# EAGLE design couch-pwr-rb (EAGLE 7.6.0)
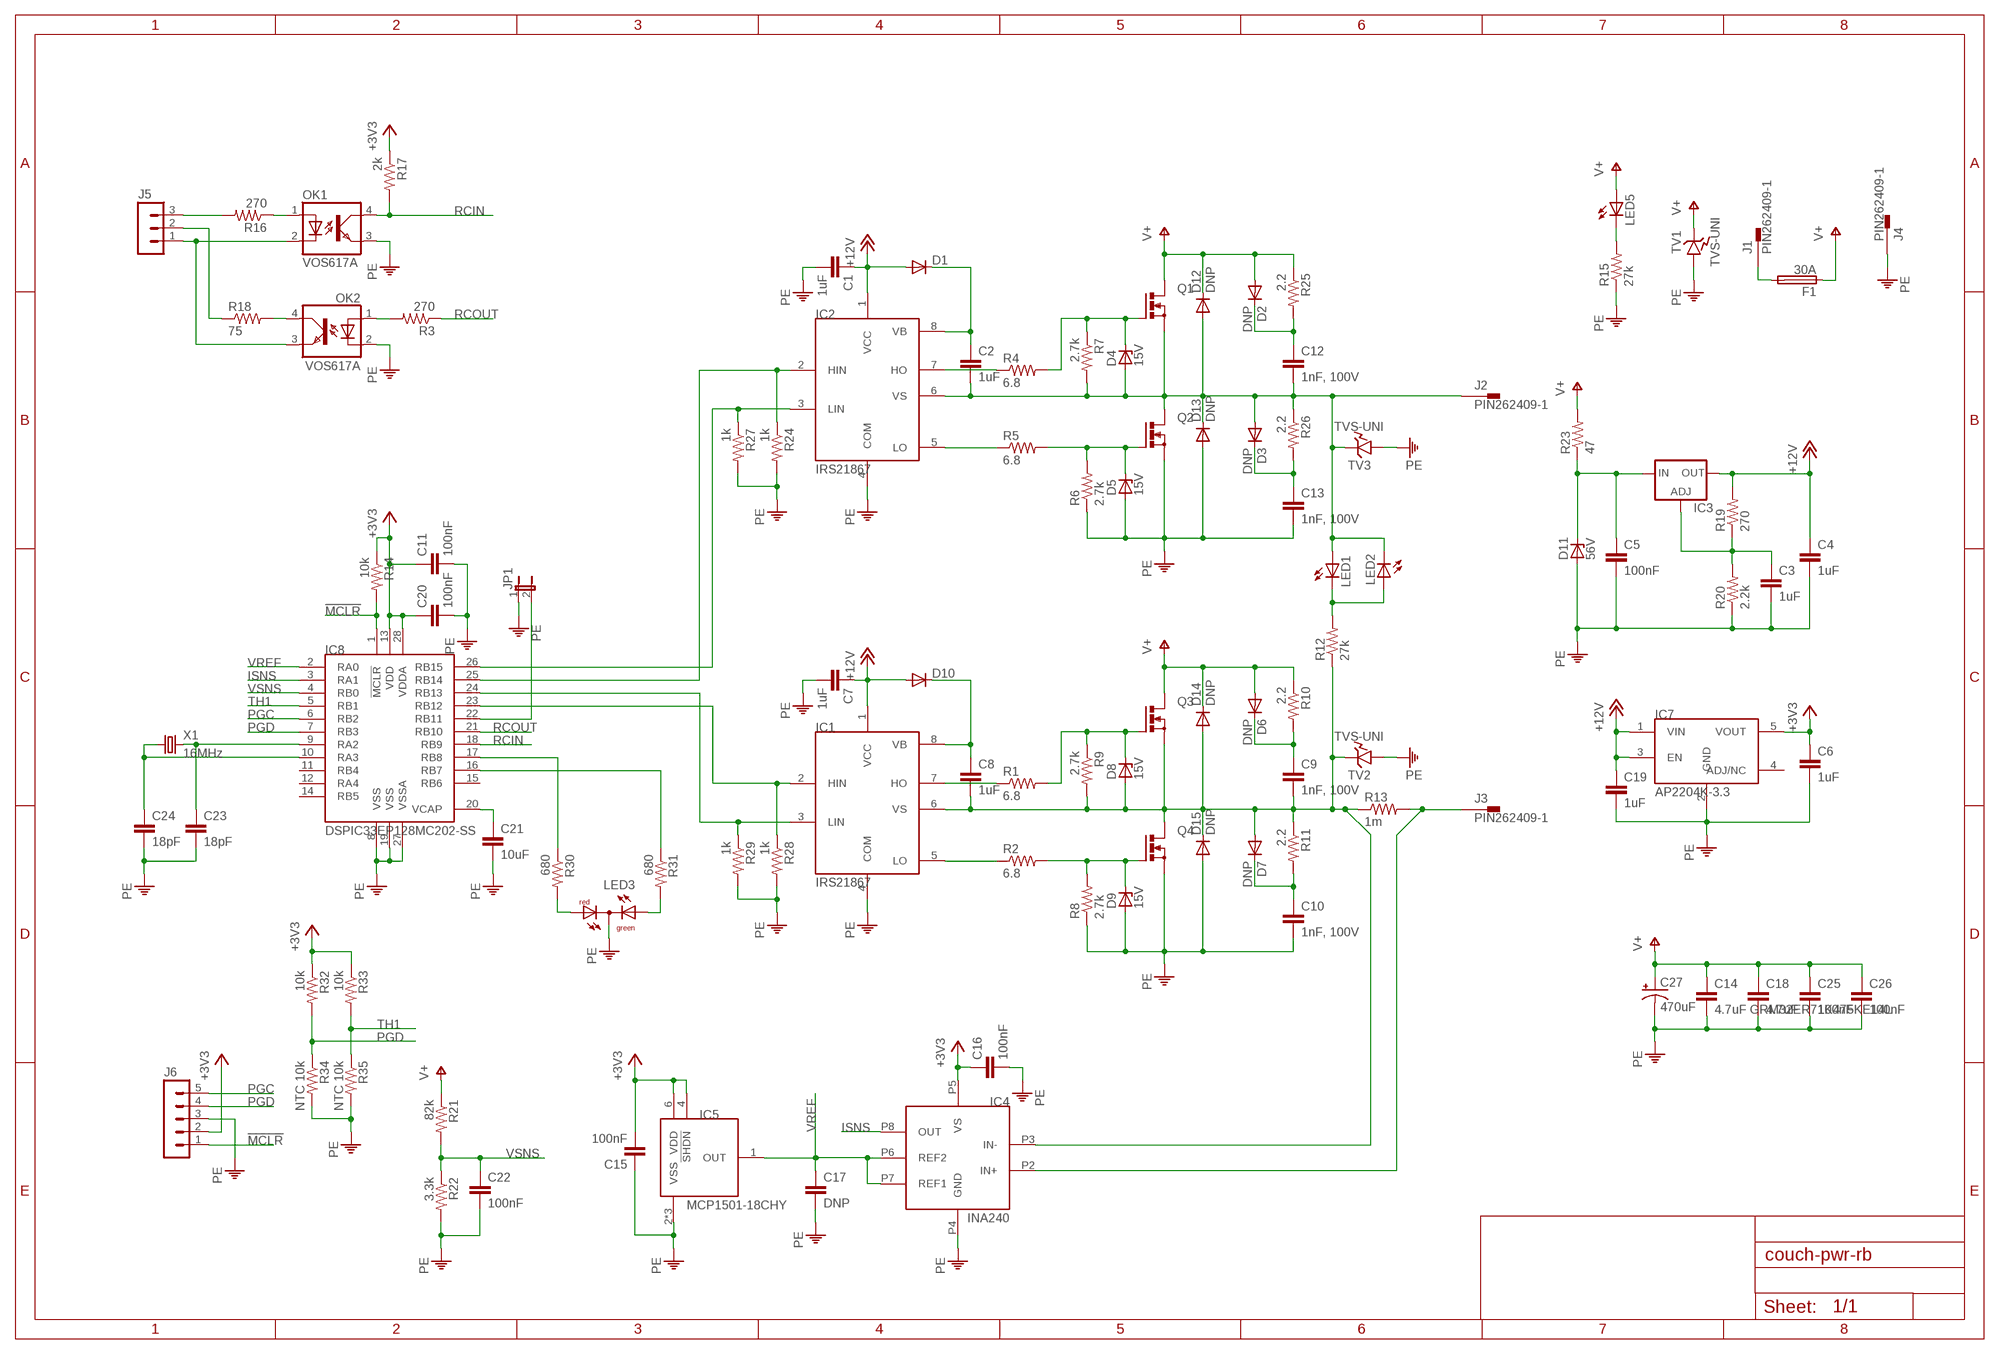
[diagram p0: schematic, sheet 1]

## Parts
C1  1uF  C-EUC0805  [C0805]
C2  1uF  C-EUC0805  [C0805]
C3  1uF  C-EUC0805  [C0805]
C4  1uF  C-EUC0805  [C0805]
C5  100nF  C-EUC0805  [C0805]
C6  1uF  C-EUC0603  [C0603]
C7  1uF  C-EUC0805  [C0805]
C8  1uF  C-EUC0805  [C0805]
C9  1nF, 100V  C-EUC1206  [C1206]
C10  1nF, 100V  C-EUC1206  [C1206]
C11  100nF  C-EUC0603  [C0603]
C12  1nF, 100V  C-EUC1206  [C1206]
C13  1nF, 100V  C-EUC1206  [C1206]
C14  4.7uF GRM32ER71K475KE14L  C-EUC1210  [C1210]
C15  100nF  C-EUC0603  [C0603]
C16  100nF  C-EUC0603  [C0603]
C17  DNP  C-EUC0603  [C0603]
C18  4.7uF  C-EUC1210  [C1210]
C19  1uF  C-EUC0603  [C0603]
C20  100nF  C-EUC0603  [C0603]
C21  10uF  C-EUC0603  [C0603]
C22  100nF  C-EUC0603  [C0603]
C23  18pF  C-EUC0603  [C0603]
C24  18pF  C-EUC0603  [C0603]
C25  100nF  C-EUC1206  [C1206]
C26  100nF  C-EUC1206  [C1206]
C27  470uF  CPOL-USE7.5-16  [E7,5-16]
D1  DIODE-SOD323-W  [SOD323-W]
D2  DNP  DIODE-DO-214AC  [DO-214AC]
D3  DNP  DIODE-DO-214AC  [DO-214AC]
D4  15V  ZENER-DIODESOD80C  [SOD80C]
D5  15V  ZENER-DIODESOD80C  [SOD80C]
D6  DNP  DIODE-DO-214AC  [DO-214AC]
D7  DNP  DIODE-DO-214AC  [DO-214AC]
D8  15V  ZENER-DIODESOD80C  [SOD80C]
D9  15V  ZENER-DIODESOD80C  [SOD80C]
D10  DIODE-SOD323-W  [SOD323-W]
D11  56V  ZENER-DIODESMB  [SMB]
D12  DNP  DIODE-SMC  [SMC]
D13  DNP  DIODE-SMC  [SMC]
D14  DNP  DIODE-SMC  [SMC]
D15  DNP  DIODE-SMC  [SMC]
F1  30A  FUSEBLADE  [BLADEFUSE]
IC1  IRS21867  [SO-08]
IC2  IRS21867  [SO-08]
IC3  LM317TLBH  [TO220BH]
IC4  INA240  [VSSOP-8]
IC5  MCP1501-18CHY  [SOT23-6]
IC7  AP2204K-3.3  AP2204K-5.0  [SOT23-5]
IC8  DSPIC33EP128MC202-SS  [SSOP-28]
J1  PIN262409-1  [62409-1]
J2  PIN262409-1  [62409-1]
J3  PIN262409-1  [62409-1]
J4  PIN262409-1  [62409-1]
J5  MA03-1  [MA03-1]
J6  MA05-1  [MA05-1]
JP1  JP1E  [JP1]
LED1  LEDCHIP-LED0603  [CHIP-LED0603]
LED2  LEDCHIP-LED0603  [CHIP-LED0603]
LED3  DUOLED-RG-C  [DUOLED-C-5MM]
LED5  LEDCHIP-LED0603  [CHIP-LED0603]
OK1  VOS617A  TLP283  [MINI-FLAT-4]
OK2  VOS617A  TLP283  [MINI-FLAT-4]
Q1  PMOSFET_NTO220BH  [TO220BH]
Q2  PMOSFET_NTO220BH  [TO220BH]
Q3  PMOSFET_NTO220BH  [TO220BH]
Q4  PMOSFET_NTO220BH  [TO220BH]
R1  6.8  R-US_R1206  [R1206]
R2  6.8  R-US_R1206  [R1206]
R3  270  R-US_R0603  [R0603]
R4  6.8  R-US_R1206  [R1206]
R5  6.8  R-US_R1206  [R1206]
R6  2.7k  R-US_R0603  [R0603]
R7  2.7k  R-US_R0603  [R0603]
R8  2.7k  R-US_R0603  [R0603]
R9  2.7k  R-US_R0603  [R0603]
R10  2.2  R-US_R1206  [R1206]
R11  2.2  R-US_R1206  [R1206]
R12  27k  R-US_R0603  [R0603]
R13  1m  R-US_R2512  [R2512]
R14  10k  R-US_R0603  [R0603]
R15  27k  R-US_R0603  [R0603]
R16  270  R-US_R0603  [R0603]
R17  2k  R-US_R0603  [R0603]
R18  75  R-US_R0603  [R0603]
R19  270  R-US_R0603  [R0603]
R20  2.2k  R-US_R0603  [R0603]
R21  82k  R-US_R0603  [R0603]
R22  3.3k  R-US_R0603  [R0603]
R23  47  R-US_R1206  [R1206]
R24  1k  R-US_R0603  [R0603]
R25  2.2  R-US_R1206  [R1206]
R26  2.2  R-US_R1206  [R1206]
R27  1k  R-US_R0603  [R0603]
R28  1k  R-US_R0603  [R0603]
R29  1k  R-US_R0603  [R0603]
R30  680  R-US_R0603  [R0603]
R31  680  R-US_R0603  [R0603]
R32  10k  R-US_R0603  [R0603]
R33  10k  R-US_R0603  [R0603]
R34  NTC 10k  R-US_R0603  [R0603]
R35  NTC 10k  R-US_R0603  [R0603]
TV1  TVS-UNI  [SMC]
TV2  TVS-UNI  [SMC]
TV3  TVS-UNI  [SMC]
X1  16MHz  CRYSTALHC49S  [HC49/S]

## Nets
!MCLR: IC8.1(!MCLR) J6.1 R14.2
+3V3: C6.1 C11.1 C15.2 C16.1 C20.1 IC4.P5(VS) IC5.4(!SHDN) IC5.6(VDD) IC7.5(VOUT) IC8.13(VDD) IC8.28(VDDA) J6.2 R14.1 R17.1 R32.1 R33.1
+12V: C1.1 C4.1 C7.1 C19.1 D1.A D10.A IC1.1(VCC) IC2.1(VCC) IC3.D(OUT) IC7.1(VIN) IC7.3(EN) R19.2
ISNS: IC4.P8(OUT) IC8.3(RA1)
MD1: C2.2 C12.2 D3.A D4.A D12.A D13.C IC2.6(VS) J2.A1 J2.A2 LED1.A LED2.C Q1.S Q2.D R7.2 R26.1 TV3.1(M1)
MD2: C8.2 C9.2 D7.A D8.A D14.A D15.C IC1.6(VS) IC4.P3(IN-) Q3.S Q4.D R9.2 R11.1 R12.1 R13.1 TV2.1(M1)
N$1: D5.C Q2.G R5.2 R6.2
N$2: F1.2A F1.2B J1.A1 J1.A2
N$3: D4.C Q1.G R4.2 R7.1
N$4: IC2.7(HO) R4.1
N$5: C2.1 D1.C IC2.8(VB)
N$6: IC2.5(LO) R5.1
N$7: C13.1 D3.C R26.2
N$8: D9.C Q4.G R2.2 R8.2
N$9: D8.C Q3.G R1.2 R9.1
N$10: IC1.7(HO) R1.1
N$11: C8.1 D10.C IC1.8(VB)
N$12: IC1.5(LO) R2.1
N$13: C9.1 D6.C R10.2
N$14: C10.1 D7.C R11.2
N$15: C5.1 D11.C IC3.S(IN) R23.1
N$16: LED1.C LED2.A R12.2
N$17: C21.1 IC8.20(VCAP)
N$18: IC1.2(HIN) IC8.23(RB12) R28.1
N$19: C23.1 IC8.9(RA2) X1.2
N$20: IC2.2(HIN) IC8.25(RB14) R24.1
N$21: LED5.C R15.2
N$22: C24.1 IC8.10(RA3) X1.1
N$23: OK2.1(A) R3.2
N$24: C12.1 D2.C R25.2
N$25: OK2.4(COL) R18.2
N$26: IC2.3(LIN) IC8.26(RB15) R27.1
N$27: IC1.3(LIN) IC8.24(RB13) R29.1
N$28: J5.1 OK1.2(C) OK2.3(EMIT)
N$29: J5.2 R18.1
N$30: IC4.P2(IN+) J3.A1 J3.A2 R13.2
N$31: J5.3 R16.2
N$32: OK1.1(A) R16.1
N$33: C3.1 IC3.G(ADJ) R19.1 R20.2
N$35: IC8.17(RB8) R30.1
N$36: IC8.16(RB7) R31.1
N$37: IC8.22(RB11) JP1.2
N$39: LED3.AR R30.2
N$40: LED3.AX(AG) R31.2
PE: C1.2 C3.2 C4.2 C5.2 C6.2 C7.2 C10.2 C11.2 C13.2 C14.2 C15.1 C16.2 C17.2 C18.2 C19.2 C20.2 C21.2 C22.2 C23.2 C24.2 C25.2 C26.2 C27.- D5.A D9.A D11.A D13.A D15.A IC1.4(COM) IC2.4(COM) IC4.P4(GND) IC5.2(VSS) IC5.3(VSS) IC5.5(VSS) IC7.2(GND) IC8.8(VSS) IC8.19(VSS) IC8.27(VSSA) J4.A1 J4.A2 J6.3 JP1.1 LED3.C OK1.3(EMIT) OK2.2(C) Q2.S Q4.S R6.1 R8.1 R15.1 R20.1 R22.2 R24.2 R27.2 R28.2 R29.2 R34.2 R35.2 TV1.2(M2) TV2.2(M2) TV3.2(M2)
PGC: IC8.6(RB2) J6.5
PGD: IC8.7(RB3) J6.4 R32.2 R34.1
RCIN: IC8.18(RB9) OK1.4(COL) R17.2
RCOUT: IC8.21(RB10) R3.1
TH1: IC8.5(RB1) R33.2 R35.1
V+: C14.1 C18.1 C25.1 C26.1 C27.+ D2.A D6.A D12.C D14.C F1.1A F1.1B LED5.A Q1.D Q3.D R10.1 R21.1 R23.2 R25.1 TV1.1(M1)
VREF: C17.1 IC4.P6(REF2) IC4.P7(REF1) IC5.1(OUT) IC8.2(RA0)
VSNS: C22.1 IC8.4(RB0) R21.2 R22.1
Unconnected: IC7.4(ADJ/NC) IC8.11(RB4) IC8.12(RA4) IC8.14(RB5) IC8.15(RB6)

## Library data of the parts
C1-C26 = resistor:C-EU: CAPACITOR, European symbol
C27 = rcl:CPOL-US: POLARIZED CAPACITOR, American symbol
D1-D3 D6 D7 D10 D12-D15 = diode:DIODE-: DIODE
D4 D5 D8 D9 D11 = diode:ZENER-DIODE: Z-Diode
F1 = william:FUSE
IC1 IC2 = william:IRS21867
IC3 = v-reg:LM317TL: VOLTAGE REGULATOR
IC4 = william:INA240
IC5 = william:MCP1501-*
IC7 = william:AP2204K-*
IC8 = william:DSPIC33EP*MC202
J1-J4 = con-faston:PIN2: Flachstecker Typ Tyco/Electronics/AMP TAB, FASTON Printed Circuit Board Tabs Source: http://www.buerklin.com, http://catalog.tycoelectronics.com; OC_FARNELL: unknown; OC_NEWARK: unknown
J5 = con-lstb:MA03-1: PIN HEADER; OC_FARNELL: unknown; OC_NEWARK: unknown
J6 = con-lstb:MA05-1: PIN HEADER; OC_FARNELL: unknown; OC_NEWARK: unknown
JP1 = jumper:JP1E: JUMPER
LED1 LED2 LED5 = led:LED: LED OSRAM: - CHIPLED LG R971, LG N971, LY N971, LG Q971, LY Q971, LO R971, LY R971 LH N974, LH R974 LS Q976, LO Q976, LY Q976 LO Q996 - Hyper CHIPLED LW Q18S LB Q993, LB Q99A, LB R99A - SideLED LS A670, LO A670, LY A670, LG A670, LP A670 LB A673, LV A673, LT A673, LW A673 LH A674 LY A675 LS A676, LA A676, LO A676, LY A676, LW A676 LS A679, LY A679, LG A679 - Hyper Micro SIDELED® LS Y876, LA Y876, LO Y876, LY Y876 LT Y87S - SmartLED LW L88C, LW L88S LB L89C, LB L89S, LG L890 LS L89K, LO L89K, LY L89K LS L896, LA L896, LO L896, LY L896 - TOPLED LS T670, LO T670, LY T670, LG T670, LP T670 LSG T670, LSP T670, LSY T670, LOP T670, LYG T670 LG T671, LOG T671, LSG T671 LB T673, LV T673, LT T673, LW T673 LH T674 LS T676, LA T676, LO T676, LY T676, LB T676, LH T676, LSB T676, LW T676 LB T67C, LV T67C, LT T67C, LS T67K, LO T67K, LY T67K, LW E67C LS E67B, LA E67B, LO E67B, LY E67B, LB E67C, LV E67C, LT E67C LW T67C LS T679, LY T679, LG T679 LS T770, LO T770, LY T770, LG T770, LP T770 LB T773, LV T773, LT T773, LW T773 LH T774 LS E675, LA E675, LY E675, LS T675 LS T776, LA T776, LO T776, LY T776, LB T776 LHGB T686 LT T68C, LB T68C - Hyper Mini TOPLED® LB M676 - Mini TOPLED Santana® LG M470 LS M47K, LO M47K, LY M47K Source: http://www.osram.convergy.de LUXEON: - LUMILED® LXK2-PW12-R00, LXK2-PW12-S00, LXK2-PW14-U00, LXK2-PW14-V00 LXK2-PM12-R00, LXK2-PM12-S00, LXK2-PM14-U00 LXK2-PE12-Q00, LXK2-PE12-R00, LXK2-PE12-S00, LXK2-PE14-T00, LXK2-PE14-U00 LXK2-PB12-K00, LXK2-PB12-L00, LXK2-PB12-M00, LXK2-PB14-N00, LXK2-PB14-P00, LXK2-PB14-Q00 LXK2-PR12-L00, LXK2-PR12-M00, LXK2-PR14-Q00, LXK2-PR14-R00 LXK2-PD12-Q00, LXK2-PD12-R00, LXK2-PD12-S00 LXK2-PH12-R00, LXK2-PH12-S00 LXK2-PL12-P00, LXK2-PL12-Q00, LXK2-PL12-R00 Source: www.luxeon.com KINGBRIGHT: KA-3528ASYC Source: www.kingbright.com
LED3 = led:DUOLED-RG-C: DUO LED 2 colors (red/green), 5 mm, round, common Cathode www.ligitek.com or other producers.
OK1 OK2 = optocoupler:TLP283: TOSHIBA PHOTOCOUPLER GaAs IRED & PHOTO-TRANSISTOR Source: http://www.semicon.toshiba.co.jp/td/en/Opto/Photocoupler/en_20050928_TLP283_datasheet.pdf; OC_FARNELL: unknown; OC_NEWARK: unknown
Q1-Q4 = transistor-power:PMOSFET_N: Power MOSFET N-Channel
R1-R35 = resistor:R-US_: RESISTOR, American symbol
TV1-TV3 = william:TVS-UNI
X1 = crystal:CRYSTAL: CRYSTAL; OC_FARNELL: 1667008; OC_NEWARK: unknown

## Board
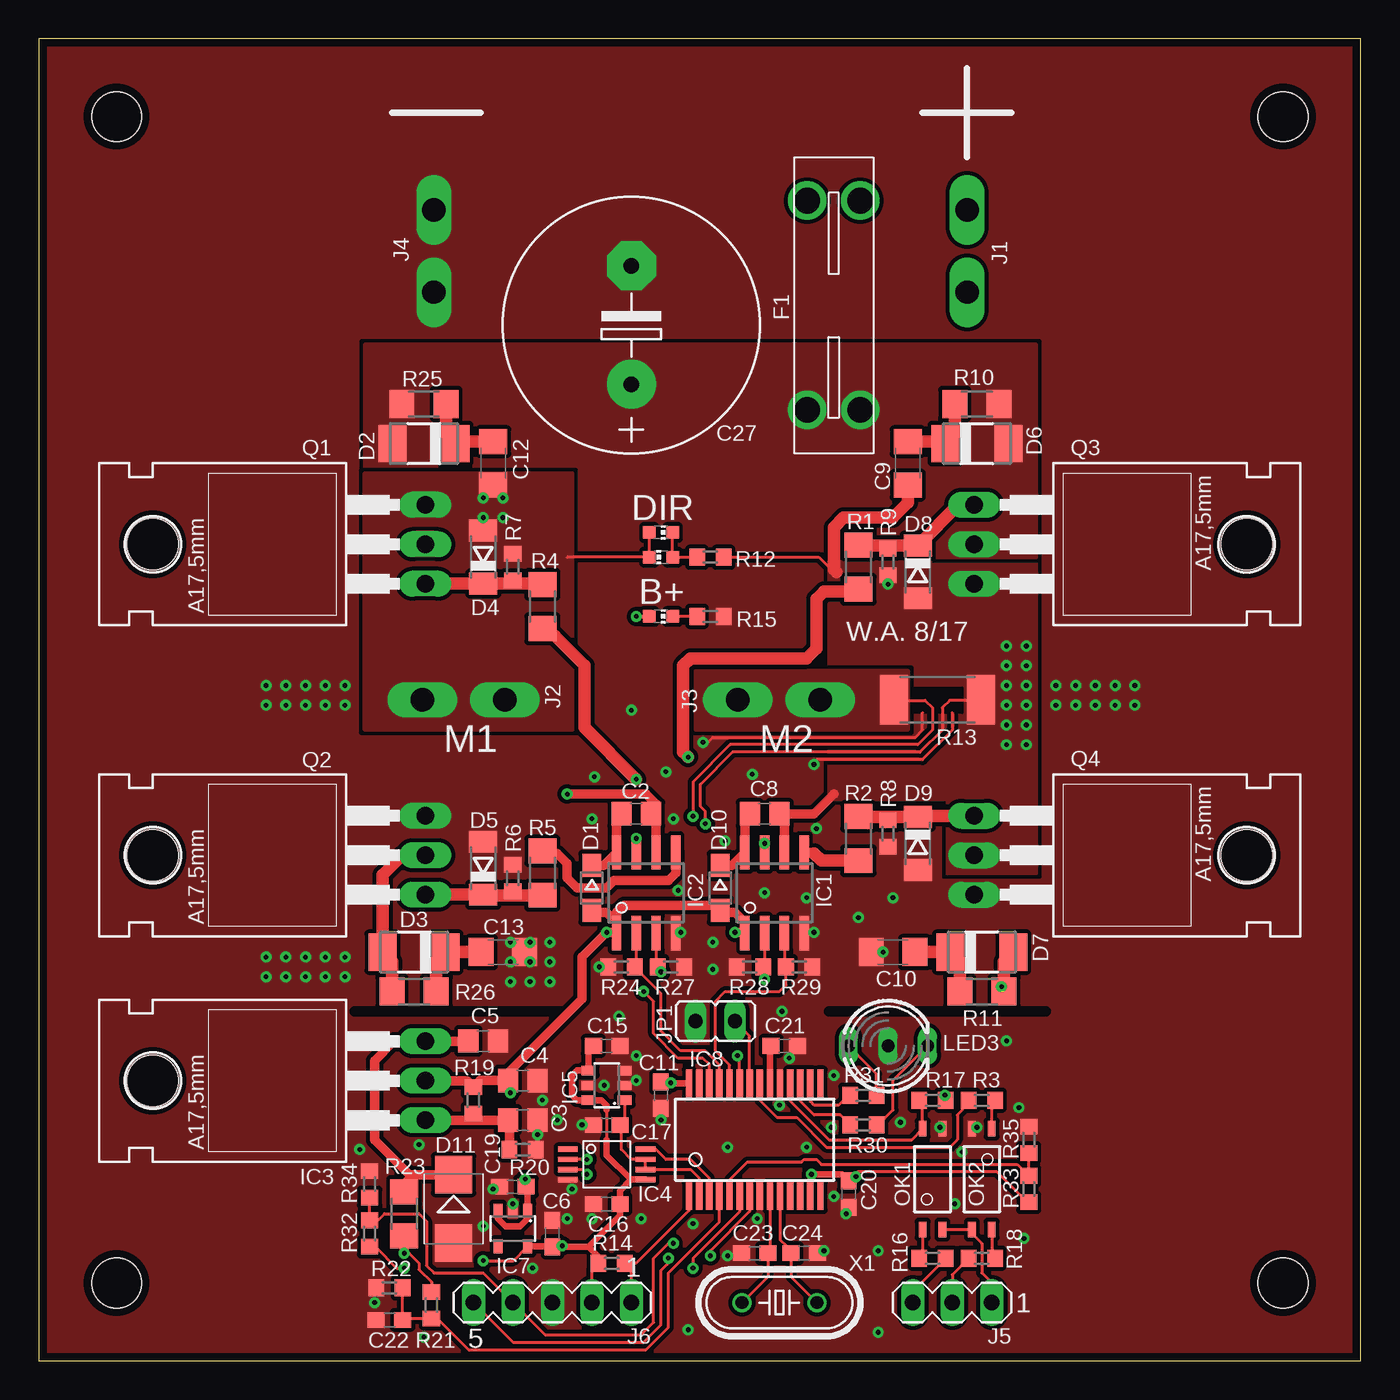
[diagram p1: board, top side]
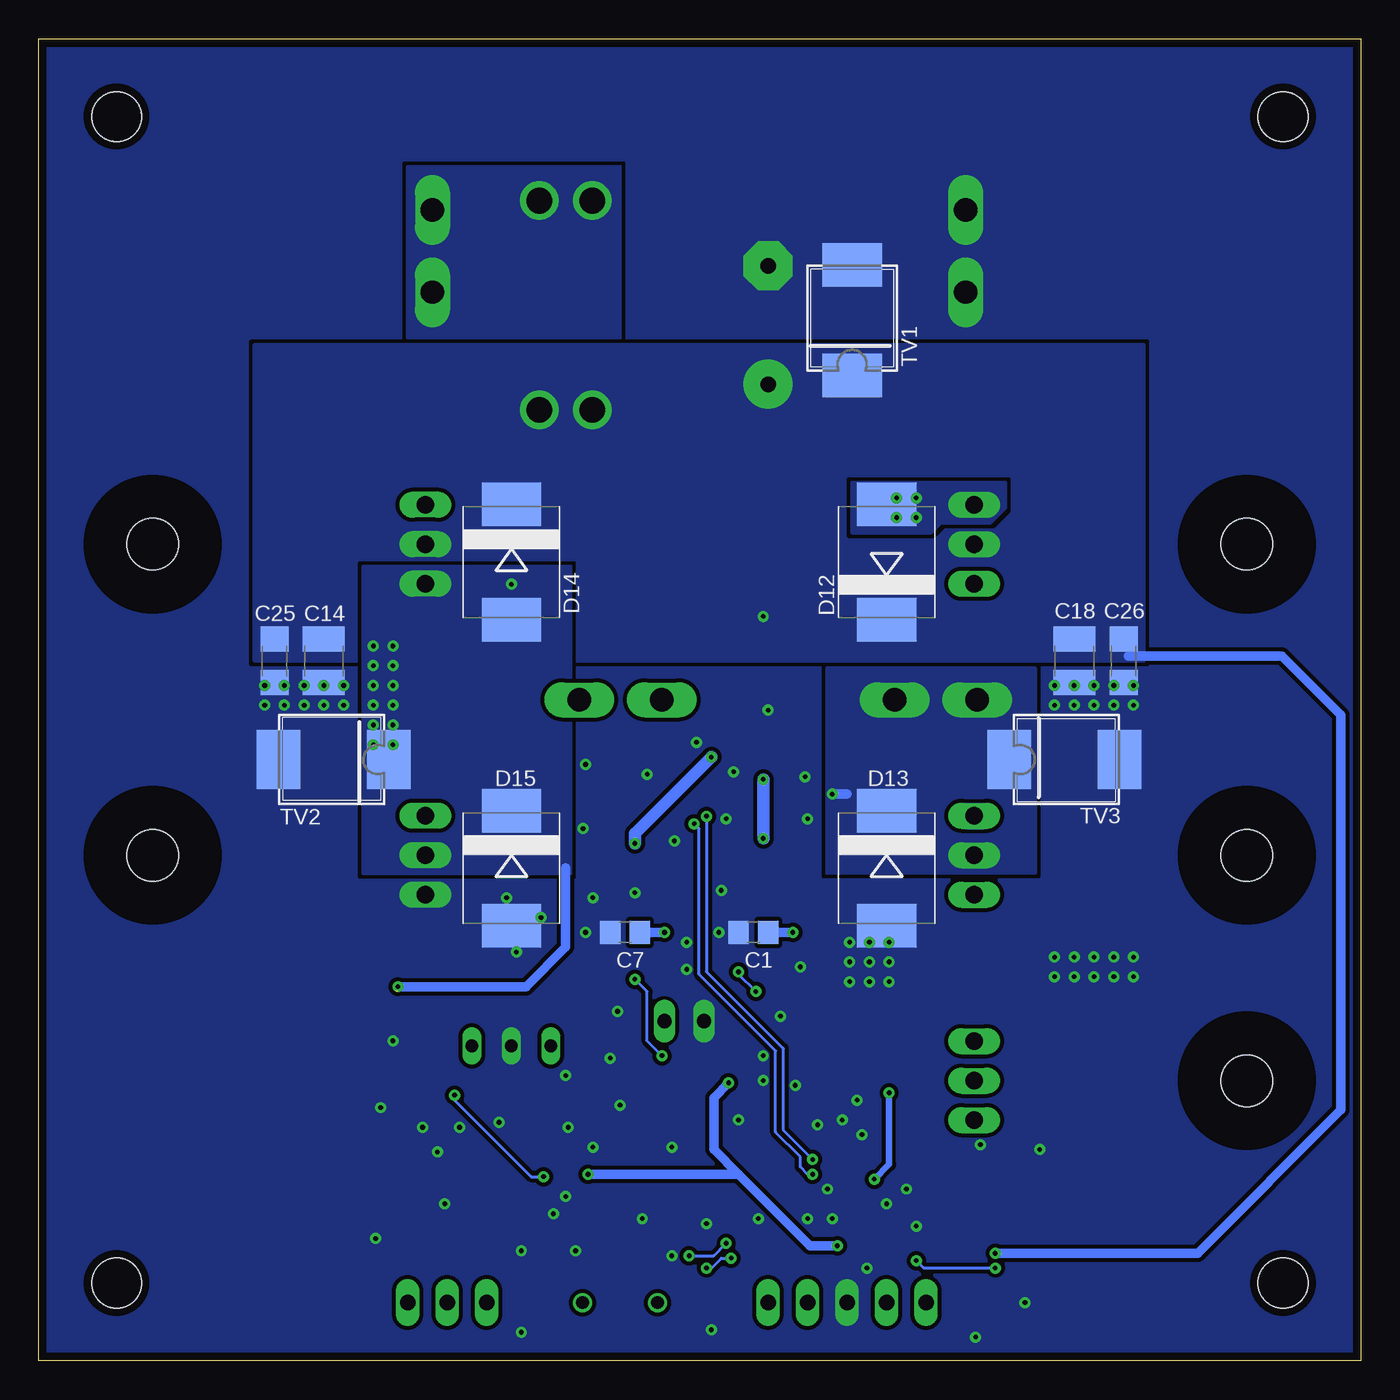
[diagram p2: board, bottom side, seen from below]

Size 85 x 85 mm. Coordinates in mm from the lower left corner, seen from the top.
Outline: 0,0 85,0 85,85 0,85 0,0
Copper layers (1*16): Top 0.035mm / dielectric 1.5mm / Bottom 0.035mm
Design rules "default *": minimum track width 8mil, minimum drill 0.3mm, track to track 8mil, track to pad 8mil, pad to pad 8mil, via to via 8mil, smd to smd 0mil, copper to edge 20mil, drill to drill 8mil, minimum pad ring 8mil, minimum via ring 8mil, stop-mask expansion 4mil, vias tented up to drill 13mil, thermal gap 10mil
Holes 3.2 mm at 5,80 5,5 80,5 80,80
tKeepout: area -5,0 to 20,85; area 65,0 to 90,85; 2 lines
tRestrict: 2 lines

### Footprints (pad centres in the part's own frame; a part is rotated, then mirrored left to right if it is on the bottom)
C0805 = smd 1.3 x 1.5: 1 -0.95,0; 2 0.95,0
C0603 = smd 1.1 x 1: 1 -0.85,0; 2 0.85,0
C1206 = smd 1.6 x 1.8: 1 -1.4,0; 2 1.4,0
C1210 = smd 1.6 x 2.7: 1 -1.4,0; 2 1.4,0
E7,5-16 = drill 1.016 pad 3.15: + -3.81,0 | drill 1.016 pad 3.15 octagon: - 3.81,0
SOD323-W = smd 1.5 x 1.2: A 1.45,0; C -1.45,0
DO-214AC = smd 1.8 x 2.4: A 2.025,0; C -2.025,0
SOD80C = smd 1.4 x 1.8: A 1.7,0; C -1.7,0
SMB = smd 2.4 x 2.4: A 2.2,0; C -2.2,0
SMC = smd 2.8 x 3.8: A 3.7,0; C -3.7,0
BLADEFUSE = drill 1.651: 1A -6.731,1.702; 1B -6.731,-1.702; 2A 6.731,1.702; 2B 6.731,-1.702
SO-08 = smd 0.6 x 2.2: 1 -1.905,-2.6; 2 -0.635,-2.6; 3 0.635,-2.6; 4 1.905,-2.6; 5 1.905,2.6; 6 0.635,2.6; 7 -0.635,2.6; 8 -1.905,2.6
TO220BH = drill 1.118 long: D 0,-10.16; G -2.54,-10.16; S 2.54,-10.16 | hole 3.302: 0,7.366
VSSOP-8 = smd 0.35 x 1.27: P1 -0.975,-2.5; P2 -0.325,-2.5; P3 0.325,-2.5; P4 0.975,-2.5; P5 0.975,2.5; P6 0.325,2.5; P7 -0.325,2.5; P8 -0.975,2.5
SOT23-6 = smd 0.6 x 0.9: 1 -0.95,-1.15; 2 0,-1.15; 3 0.95,-1.15; 4 0.95,1.15; 5 0,1.15; 6 -0.95,1.15
SOT23-5 = smd 0.6 x 0.9: 1 -0.95,-1.15; 2 0,-1.15; 3 0.95,-1.15; 4 0.95,1.15; 5 -0.95,1.15
SSOP-28 = smd 0.406 x 1.778: 1 -4.225,-3.625; 2 -3.575,-3.625; 3 -2.925,-3.625; 4 -2.275,-3.625; 5 -1.625,-3.625; 6 -0.975,-3.625; 7 -0.325,-3.625; 8 0.325,-3.625; 9 0.975,-3.625; 10 1.625,-3.625; 11 2.275,-3.625; 12 2.925,-3.625; 13 3.575,-3.625; 14 4.225,-3.625; 15 4.225,3.625; 16 3.575,3.625; 17 2.925,3.625; 18 2.275,3.625; 19 1.625,3.625; 20 0.975,3.625; 21 0.325,3.625; 22 -0.325,3.625; 23 -0.975,3.625; 24 -1.625,3.625; 25 -2.275,3.625; 26 -2.925,3.625; 27 -3.575,3.625; 28 -4.225,3.625
62409-1 = drill 1.5 pad 1.9 long: A1 -2.65,0; A2 2.65,0
MA03-1 = drill 1.016 long: 1 -2.54,0; 2 0,0; 3 2.54,0
MA05-1 = drill 1.016 long: 1 -5.08,0; 2 -2.54,0; 3 0,0; 4 2.54,0; 5 5.08,0
JP1 = drill 0.914 long: 1 0,-1.27; 2 0,1.27
CHIP-LED0603 = smd 0.8 x 0.8: A 0,-0.75; C 0,0.75
DUOLED-C-5MM = drill 0.813 long: AR 2.54,0; AX -2.54,0; C 0,0
MINI-FLAT-4 = smd 1 x 0.5: 1 -3.24,0.635; 2 -3.24,-0.635; 3 3.24,-0.635; 4 3.24,0.635
TO220BH' = drill 1.118 long: D 0,-6.35; G -2.54,-6.35; S 2.54,-6.35 | hole 3.302: 0,11.176
R1206 = smd 1.6 x 1.803: 1 -1.422,0; 2 1.422,0
R0603 = smd 1 x 1.1: 1 -0.85,0; 2 0.85,0
R2512 = smd 1.8 x 3.2: 1 -2.8,0; 2 2.8,0
SMC' = smd 2.794 x 3.81: 1 -3.556,0; 2 3.556,0
HC49/S = drill 0.813: 1 -2.413,0; 2 2.413,0

### Placement (x,y rotation side)
C1  39.05,27.54 180 bottom
C2  38.42,35.16 0 top
C3  31.11,15.48 0 top
C4  31.11,18.02 0 top
C5  28.57,20.56 0 top
C6  33.02,8.18 90 top
C7  47.31,27.54 180 bottom
C8  46.67,35.16 0 top
C9  55.88,57.7 270 top
C10  54.93,26.27 180 top
C11  40.01,17.06 270 top
C12  29.21,57.7 270 top
C13  29.84,26.27 0 top
C14  66.67,45.01 270 bottom
C15  36.51,20.24 180 top
C16  36.51,10.08 180 top
C17  36.51,15.16 180 top
C18  18.41,45.01 270 bottom
C19  30.48,11.19 180 top
C20  52.07,10.71 270 top
C21  47.94,20.24 0 top
C22  22.54,2.62 180 top
C23  46.04,6.91 180 top
C24  49.21,6.91 0 top
C25  69.85,45.01 270 bottom
C26  15.24,45.01 270 bottom
C27  38.1,66.59 90 top
D1  35.56,30.4 270 top
D2  24.77,58.98 180 top
D3  24.13,26.27 180 top
D4  28.57,51.67 90 top
D5  28.57,31.67 90 top
D6  60.33,58.98 0 top
D7  60.64,26.27 0 top
D8  56.52,50.72 270 top
D9  56.52,33.26 270 top
D10  43.81,30.4 270 top
D11  26.67,9.76 270 top
D12  30.48,51.35 90 bottom
D13  30.48,31.67 270 bottom
D14  54.61,51.35 270 bottom
D15  54.61,31.67 270 bottom
F1  51.12,67.87 90 top
IC1  47.31,30.08 0 top
IC2  39.05,30.08 0 top
IC3  14.69,18 90 top
IC4  36.51,12.62 270 top
IC5  36.51,17.7 90 top
IC7  30.48,8.49 180 top
IC8  46.04,14.21 0 top
J1  59.69,71.36 270 top
J2  27.3,42.5 180 top
J3  47.59,42.5 180 top
J4  25.4,71.36 90 top
J5  58.74,3.73 180 top
J6  33.02,3.73 180 top
JP1  43.5,21.83 270 top
LED1  40.01,53.26 270 top
LED2  40.01,51.67 90 top
LED3  54.61,20.24 0 top
LED5  40.01,47.86 270 top
OK1  57.47,11.67 90 top
OK2  60.64,11.67 270 top
Q1  [TO220BH']  18.5,52.5 90 top
Q2  [TO220BH']  18.5,32.5 90 top
Q3  [TO220BH']  66.5,52.5 270 top
Q4  [TO220BH']  66.5,32.5 270 top
R1  52.7,51.04 90 top
R2  52.7,33.58 90 top
R3  60.64,16.75 0 top
R4  32.38,48.5 90 top
R5  32.38,31.35 270 top
R6  30.48,31.04 270 top
R7  30.48,51.04 90 top
R8  54.61,33.89 90 top
R9  54.61,51.35 270 top
R10  60.33,61.52 180 top
R11  60.64,23.73 180 top
R12  43.18,51.67 180 top
R13  57.78,42.5 180 top
R14  36.83,6.27 0 top
R15  43.18,47.86 180 top
R16  57.47,6.59 0 top
R17  57.47,16.75 180 top
R18  60.64,6.59 0 top
R19  27.94,16.75 90 top
R20  31.11,13.57 180 top
R21  25.24,3.57 270 top
R22  22.54,4.68 180 top
R23  23.5,9.45 270 top
R24  37.47,25.32 180 top
R25  24.77,61.52 0 top
R26  24.13,23.73 0 top
R27  40.64,25.32 0 top
R28  45.72,25.32 180 top
R29  48.9,25.32 0 top
R30  53.02,15.16 0 top
R31  53.02,17.06 0 top
R32  21.27,8.18 90 top
R33  63.66,11.03 90 top
R34  21.27,11.35 90 top
R35  63.66,14.21 90 top
TV1  TVS-UNI  [SMC']  32.7,66.91 90 bottom
TV2  TVS-UNI  [SMC']  66.04,38.66 180 bottom
TV3  TVS-UNI  [SMC']  19.05,38.66 0 bottom
X1  47.62,3.73 180 top

### Tracks (layer width: path | path; a pad name or v marks a point on that pad's centre or on a via)
!MCLR
  Top 0.203: J6.1 38.1,5.85 R14.2 38.42,6.27 41.81,9.66 IC8.1
+3V3  (via drill 0.3)
  Top 0.203: J6.2 35.56,5.85 R14.1 | R33.1 63.56,10.18 61.59,12.14 52.65,12.14 C20.1 52.13,11.51 v52.55,11.83 | R32.1 21.65,7.33 23.02,5.95 v23.5,5.95 | v28.57,6.43 30.52,6.43 IC7.5 | 36.51,16.11 36.51,14.21 | v33.66,7.38 33.66,7.33
  Top 0.406: IC4.P5 38.08,11.64 | 38.08,11.64 37.36,10.93 C16.1 37.36,9.34 35.34,7.33 | IC8.28 40.09,17.83 C11.1 | IC8.13 49.61,11.75 v49.69,11.98 51.65,11.98 C20.1 | IC7.5 33,7.34 C6.1 33.66,7.33 35.34,7.33 | R14.1 35.98,6.69 35.34,7.33 | C15.2 35.36,19.94 IC5.4 34.61,18.65 34.29,18.34 34.29,17.06 34.6,16.75 IC5.6 36.19,16.75 36.51,16.43 36.51,16.11 | 36.51,14.21 36.51,13.21 38.08,11.64
  Top 0.61: 40.09,17.83 40.61,17.83 v40.64,17.86 | R17.1 58.32,17.01 v58.26,17.06
  Bottom 0.203: v23.5,5.95 28.1,5.95 v28.57,6.43 | v58.26,17.06 58.26,16.75 53.34,11.83 v52.55,11.83
  Bottom 0.61: v33.66,7.38 35.4,7.38 40.01,11.98 | 40.01,11.98 v49.69,11.98 | 40.01,11.98 41.59,13.57 41.59,16.91 v40.64,17.86
+12V  (via drill 0.3)
  Top 0.406: IC7.3 29.53,9.12 30,8.65 30.96,8.65 31.43,9.13 IC7.1 31.43,10.93 C19.1 31.33,11.61 v31.27,11.67 | v30.32,17.22 30.32,17.86 C4.1
  Top 0.61: IC3.D 27.54,18 R19.2 28.36,18.02 C4.1 30.16,18.5 34.92,23.26 34.92,25.95 v36.51,27.54 37.09,27.54 IC2.1 | IC2.1 37.15,28.18 36.51,28.81 35.7,28.81 D1.A | v44.77,27.54 45.34,27.54 IC1.1 45.4,28.18 44.77,28.81 43.95,28.81 D10.A 43.48,29.29 37.62,29.29 37.15,28.81 IC2.1
  Bottom 0.406: v31.27,11.67 30.32,12.62 v30.32,17.22
  Bottom 0.61: C7.1 v44.77,27.54 | C1.1 v36.51,27.54
ISNS
  Top 0.203: IC8.3 43.11,11.73 41.91,12.94 40.32,12.94 39.69,13.57 39.03,13.57 IC4.P8
MD1  (via drill 0.3)
  Top 0.203: LED1.A LED2.C 33.97,51.67
  Top 0.406: C2.2 39.69,35.16
  Top 0.61: IC2.6 39.69,34.84 C2.2 | 39.69,35.16 39.69,35.8 39.05,36.43 v33.97,36.43
  Top 0.813: R26.1 22.71,25.67 D3.A 22.11,31.23 23.37,32.5 Q2.D
  Bottom 0.61: v33.97,36.43 33.02,36.43
  other vias: 28.57,55.48 29.84,55.48 28.57,54.21 29.84,54.21
  pour Top (isolate 0.254, no thermals): 20.95,57.07 34.29,57.07 34.29,40.56 20.95,40.56
  pour Bottom (isolate 0.254, no thermals): 34.29,44.53 20.95,44.53 20.95,31.35 34.29,31.35
  pour Bottom (isolate 0.254, no thermals): 22.86,54.85 22.86,56.44 32.7,56.44 32.7,53.26 27.62,53.26 26.99,53.9 23.81,53.9
MD2  (via drill 0.3)  (1 unrouted)
  Top 0.203: R12.1 50.16,51.67 50.8,51.04 | R13.1 60.55,42.47 58.58,42.47 58.1,41.99 58.1,40.56 56.67,39.13 44.61,39.13 42.55,37.07 42.55,35.64 42.86,35.32 v42.86,34.53 | IC4.P3 34.93,12.29 v35.24,11.98
  Top 0.406: C8.2 47.94,35.16
  Top 0.61: IC1.6 47.94,34.84 C8.2 | v61.91,24.05 61.91,23.73 | 47.94,35.16 49.85,35.16 51.12,36.43
  Top 0.813: R11.1 62.06,25.67 D7.A | C9.2 55.88,55.16 54.93,54.21 51.75,54.21 51.12,53.58 51.12,50.88 51.28,50.72
  Bottom 0.203: v35.24,11.98 35.56,11.98 36.04,12.46 36.04,13.1 37.62,14.68 37.62,19.92 42.55,24.84 42.55,34.21 v42.86,34.53
  Bottom 0.61: 51.12,31.67 51.12,26.59 53.66,24.05 v61.91,24.05
  other vias: 63.5,43.42 63.5,44.69 63.5,42.15 63.5,40.88 63.5,39.61 62.23,43.42 62.23,44.69 62.23,42.15 62.23,40.88 62.23,39.61 62.23,45.96 63.5,45.96 54.61,49.93
  pour Bottom (isolate 0.254, no thermals): 50.8,51.04 64.14,51.04 64.14,31.35 50.8,31.35
  pour Top (isolate 0.254, rank 3, no thermals): 64.14,51.35 50.8,51.35 50.8,36.11 58.42,36.11 58.42,31.35 64.14,31.35
N$1
  Top 0.813: Q2.G 24.77,29.97 D5.C 28.61,29.93 30.48,29.93 | 30.48,29.93 R5.2 | R6.2 30.48,29.93
N$2
  pour Bottom (isolate 0.254, rank 5, no thermals): 47.62,65.8 47.62,76.75 61.28,76.75 61.28,65.8
N$3
  Top 0.813: Q1.G 28.89,49.96 | 28.89,49.96 30.48,49.96 | 30.48,49.96 32.36,49.96 R4.2 | R7.1 30.48,49.96 | D4.C 28.88,49.97 28.89,49.96
N$4  (via drill 0.3)
  Top 0.61: IC2.7 v38.42,33.58
  Top 0.813: v38.42,37.38 35.08,40.72 35.08,44.69 33.18,46.59 32.54,47.23 R4.1
  Bottom 0.813: v38.42,33.58 v38.42,37.38
N$5
  Top 0.61: C2.1 37.15,34.84 IC2.8 36.31,31.85 D1.C
N$6
  Top 0.61: IC2.5 40.96,31.35 40.48,30.88 36.99,30.88 36.51,30.4 34.61,30.4 33.97,31.04 33.97,31.99 33.34,32.62 32.54,32.62 R5.1
N$7
  Top 0.813: R26.2 25.55,25.67 D3.C C13.1
N$8
  Top 0.813: Q4.G 56.6,35.04 D9.C 54.61,34.96 | 54.61,34.96 52.74,34.96 R2.2 | R8.2 54.61,34.96
N$9
  Top 0.813: Q3.G 59.13,55.04 D8.C 54.61,52.42 | 54.61,52.42 52.74,52.42 R1.2 | R9.1 54.61,52.42
N$10  (via drill 0.3)
  Top 0.61: IC1.7 v46.67,33.26
  Top 0.813: v41.75,38.81 41.43,39.13 41.43,44.69 41.91,45.16 49.37,45.16 50.01,45.8 50.01,48.97 50.48,49.45 52.54,49.45 R1.1
  Bottom 0.813: v46.67,33.26 46.67,33.89 v41.75,38.81
N$11
  Top 0.61: C8.1 45.4,34.84 IC1.8 44.57,31.85 D10.C
N$12
  Top 0.61: IC1.5 49.79,32.68 49.85,32.62
  Top 0.813: 49.85,32.62 50.32,32.15 R2.1
N$13
  Top 0.813: R10.2 58.9,59.58 D6.C 58.17,59.1 C9.1
N$14
  Top 0.813: C10.1 D7.C 59.22,25.67 R11.2
N$15
  Top 0.61: C5.1 27.45,20.54 IC3.S 24.75,20.56 22.86,20.56 21.59,19.29 21.59,14.21 23.84,11.96 24.13,11.96 | D11.C 24.13,11.96 | R23.1 23.5,11.33 24.13,11.96
N$16
  Top 0.203: LED1.C LED2.A R12.2
N$17
  Top 0.406: IC8.20 47.01,20.16 C21.1
N$18  (via drill 0.3)
  Top 0.203: IC1.2 46.67,25.42 R28.1 46.67,25.22 v46.67,24.53 | IC8.23 45.06,19.42 v44.93,19.61
  Bottom 0.203: v44.93,19.61 45.88,20.56 45.88,23.73 v46.67,24.53
N$19
  Top 0.203: IC8.9 47.01,7.03 C23.1 46.89,5.41 X1.2
N$20
  Top 0.203: IC2.2 38.42,25.42 R24.1 40.01,23.63 40.01,21.19 41.27,19.92 42.86,19.92 43.76,19.02 IC8.25
N$21
  Top 0.203: R15.2 LED5.C
N$22
  Top 0.203: IC8.10 47.66,7.76 48.42,7.06 48.42,6.96 C24.1 48.36,5.41 X1.1
N$23
  Top 0.203: OK2.1 61.28,16.53 R3.2
N$24
  Top 0.813: C12.1 26.92,59.1 D2.C 26.19,59.58 R25.2
N$25
  Top 0.203: OK2.4 61.28,6.8 R18.2
N$26  (via drill 0.3)
  Top 0.203: IC2.3 39.69,25.42 R27.1 40.01,25.11 v40.01,25 | IC8.26 43.11,19.04 42.7,19.45 41.12,19.45 39.53,21.03 39.53,23.1 v38.89,23.73
  Bottom 0.203: v38.89,23.73 40.01,24.84 v40.01,25
N$27
  Top 0.203: IC1.3 47.94,25.42 R29.1 48.05,24.15 47.62,23.73 44.13,23.73 43.5,23.1 43.5,19.92 44.41,19.01 IC8.24
N$28
  Top 0.203: OK1.2 OK2.3 60.01,8.18 60.64,7.54 60.64,5.63 61.28,5 J5.1
N$29
  Top 0.203: R18.1 58.74,5.53 J5.2
N$30  (via drill 0.3)
  Top 0.203: 55.88,42.47 56.99,42.47 57.47,41.99 57.47,40.56 56.52,39.61 44.45,39.61 42.07,37.23 v42.07,35 | v35.24,12.94 34.02,12.94 IC4.P2
  Bottom 0.203: v42.07,35 42.07,25 37.15,20.08 37.15,14.84 v35.24,12.94
  pour Top (isolate 0.254, no thermals): 55.88,40.56 42.23,40.56 42.23,44.37 55.88,44.37
N$31
  Top 0.203: R16.2 56.2,4.47 J5.3
N$32
  Top 0.203: OK1.1 56.83,6.8 R16.1
N$33
  Top 0.61: IC3.G 27.94,15.46 | 27.94,15.46 30.15,15.46 C3.1 30.27,15.38 R20.2 | R19.1 27.94,15.46
N$35
  Top 0.203: R30.1 51.54,15.79 49.85,15.79 48.96,16.68 IC8.17
N$36
  Top 0.203: R31.1 52.07,17.06 51.44,16.43 49.85,16.43 49.61,16.66 IC8.16
N$37
  Top 0.203: IC8.22 45.71,20.88 JP1.2
N$39
  Top 0.203: R30.2 53.98,15.16 54.93,16.11 54.93,18.02 LED3.AR
N$40
  Top 0.203: R31.2 53.87,18.44 LED3.AX
N$41
  cutout Top (isolate 0.254): 56.2,43.26 59.37,43.26 59.37,41.67 56.2,41.67
PE  (via drill 0.3)
  Top 0.203: 56.83,41.67 56.83,40.56 56.36,40.08 43.34,40.08 43.02,39.77 v42.7,39.77 | 58.74,41.67 58.74,40.56 56.83,38.66 50.01,38.66 49.85,38.5 v49.85,38.34
  other vias: 38.73,9.13 14.61,43.42 15.88,43.42 17.14,43.42 18.41,43.42 19.68,43.42 14.61,42.15 15.88,42.15 17.14,42.15 18.41,42.15 19.68,42.15 65.41,43.42 66.67,43.42 67.94,43.42 69.22,43.42 70.48,43.42 65.41,42.15 66.67,42.15 67.94,42.15 69.22,42.15 70.48,42.15 30.48,10.08 29.21,11.03 41.27,27.54 49.85,27.54 47.62,16.43 48.26,19.45 55.4,15.32 57.94,15 60.33,15 38.42,19.61 38.42,18.02 37.31,22.14 43.34,26.91 43.34,25.16 40.8,34.84 44.13,33.42 21.59,3.73 20.64,13.57 24.45,13.89 32.38,16.75 33.34,15.48 34.92,15.16 52.7,28.5 54.29,26.27 54.93,29.77 62.23,20.56 63.02,16.27 58.9,10.08 63.34,7.86 53.98,7.06 51.91,9.45 50.48,7.06 30.32,26.91 31.59,26.91 32.86,26.91 32.86,25.64 31.59,25.64 30.32,25.64 30.32,24.37 31.59,24.37 32.86,24.37 36.04,25.32 35.56,9.13 33.97,9.13 34.29,11.03 32.07,14.53 36.35,17.7 14.61,25.95 15.88,25.95 17.14,25.95 18.41,25.95 19.68,25.95 14.61,24.68 15.88,24.68 17.14,24.68 18.41,24.68 19.68,24.68 24.77,1.51 31.75,5.95 41.75,1.98 44.29,6.75 53.98,1.83 40.01,15.48 44.29,13.73 42.07,8.81 47.78,22.46 28.57,8.65 50.96,15 51.12,18.34 49.37,13.73 59.37,13.41 51.12,10.56 46.2,9.13 40.32,37.86 38.1,41.83 35.72,37.54 35.56,34.84 45.88,37.7 50.01,34.21 41.12,30.24 46.67,30.08 49.37,29.77
  pour Top (isolate 0.254, rank 6, no thermals): 0,85 85.72,85 85.72,0 0,0
  pour Bottom (isolate 0.254, rank 6, no thermals): 85.72,85 0,85 0,0 85.72,0
PGC  (via drill 0.3)
  Top 0.203: IC8.6 45.06,9.58 42.07,6.59 v42.07,5.95 | J6.5 30.48,1.19 38.89,1.19 40.01,2.3 40.01,5.79 40.4,6.19 v40.48,6.59
  Bottom 0.203: v42.07,5.95 41.75,5.95 41.12,6.59 v40.48,6.59
PGD  (via drill 0.3)
  Top 0.203: R34.1 R32.2 21.8,9.03 22.23,9.45 24.45,9.45 24.92,8.97 24.92,6.11 25.4,5.63 28.57,5.63 J6.4 32.54,1.67 38.73,1.67 39.53,2.46 39.53,6.59 40.48,7.54 v40.8,7.54 | IC8.7 45.71,9.6 43.18,7.06 v43.18,6.75
  Bottom 0.203: v43.18,6.75 41.59,6.75 v40.8,7.54
RCIN
  Top 0.203: R17.2 56.83,16.53 OK1.4 56.13,14.21 50.8,14.21 48.31,16.7 IC8.18
RCOUT
  Top 0.203: IC8.21 46.36,16.74 47.47,15.64 48.74,15.64 50.64,13.73 58.58,13.73 59.05,14.21 59.05,15.79 59.79,16.53 R3.1
TH1
  Top 0.203: R33.2 R35.1 | R33.2 63.66,12.3 | IC8.5 44.41,11.63 45.56,12.78 49.05,12.78 49.21,12.94 50.01,12.94 50.32,12.62 62.92,12.62 R33.2
V+  (via drill 0.3)
  Top 0.203: v23.5,6.91 23.81,6.91 24.45,6.27 24.45,5.85 25.24,5.06 R21.1
  Top 0.254: v38.42,47.86 LED5.A
  Top 0.61: R23.2 v23.5,6.91
  Bottom 0.61: v23.5,6.91 10.48,6.91 1.27,16.11 1.27,41.51 5.08,45.32 14.92,45.32
  pour Bottom (isolate 0.254, rank 4, no thermals): 13.97,45.01 71.12,45.01 71.12,65.33 13.97,65.33
  pour Top (isolate 0.254, rank 2, no thermals): 20.95,51.67 64.14,51.67 64.14,65.33 20.95,65.33
VREF
  Top 0.203: IC5.1 37.66,15.46 C17.1 37.47,15.06 37.47,13.57 38.09,12.95 IC4.P7 IC4.P6 41.92,12.29 42.46,11.75 IC8.2
VSNS
  Top 0.203: R22.1 C22.1 23.5,2.72 R21.2 25.56,2.78 27.62,0.71 39.05,0.71 40.48,2.14 40.48,5.63 43.76,8.92 IC8.4

### Text on the board
tPlace: DIR | B+ | W.A. 8/17 | M1 | M2